# Altium schematic sheet BalEv_STM_v1_0.SchDoc
size A4; CompanyName: HESSO; Address1: Route du Rawyl 47; Address2: 1950 Sion; Address3: Switzerland; DocumentNumber: 3; SheetNumber: 2; SheetTotal: 8; PageSetup: Record=PageOptions|CenterHorizontal=True|CenterVertical=True|PrintScale=1.00|XCorrection=1.00|YCorrection=1.00|PrintKind=1|BorderSize=5000000|LeftOffset=0|BottomOffset=0|Orientation=2|PaperLength=1000|PaperWidth=1000|Scale=100|PaperSource=15|PrintQuality=1200|MediaType=1|DitherType=10|PrintScaleMode=1|PaperKind=A4|PaperIndex=9; ProjectName: Project Name
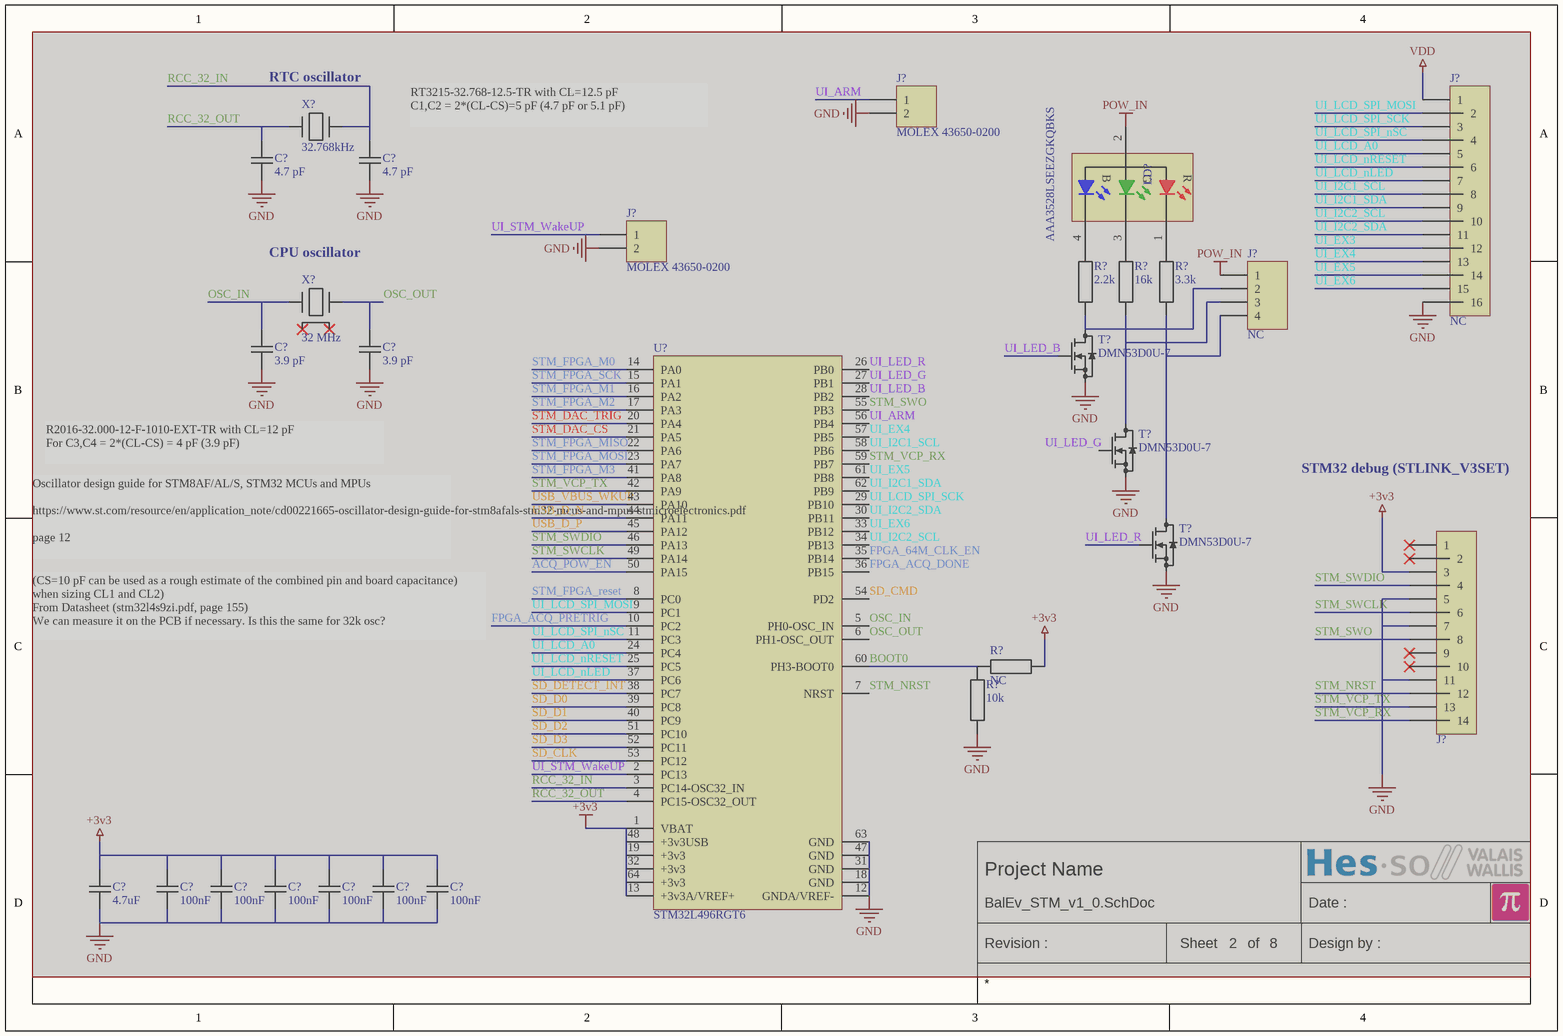
[diagram p0: BalEv_STM_v1_0.SchDoc]

## Parts
(Parts that share a designator on the sheet are numbered #1, #2 ... from top to bottom, then left to right.)
C?#1  4.7 pF  [CAPACITOR 1005 REFLOW]  (masked out: inside a compile mask, not in the netlist)
C?#2  4.7 pF  [CAPACITOR 1005 REFLOW]  (masked out: inside a compile mask, not in the netlist)
C?#3  3.9 pF  [CAPACITOR 1005 REFLOW]  (masked out: inside a compile mask, not in the netlist)
C?#4  3.9 pF  [CAPACITOR 1005 REFLOW]  (masked out: inside a compile mask, not in the netlist)
C?#5  4.7uF  [CAPACITOR 1608 REFLOW]  (masked out: inside a compile mask, not in the netlist)
C?#6  100nF  [CAPACITOR 1005 REFLOW]  (masked out: inside a compile mask, not in the netlist)
C?#7  100nF  [CAPACITOR 1005 REFLOW]  (masked out: inside a compile mask, not in the netlist)
C?#8  100nF  [CAPACITOR 1005 REFLOW]  (masked out: inside a compile mask, not in the netlist)
C?#9  100nF  [CAPACITOR 1005 REFLOW]  (masked out: inside a compile mask, not in the netlist)
C?#10  100nF  [CAPACITOR 1005 REFLOW]  (masked out: inside a compile mask, not in the netlist)
C?#11  100nF  [CAPACITOR 1005 REFLOW]  (masked out: inside a compile mask, not in the netlist)
J?#1  MOLEX 43650-0200  [MOLEX 43650-0200]  (masked out: inside a compile mask, not in the netlist)
J?#2  NC  [FlatCable2x8 2MM Right Angle TH FCI 98614-G61-16ULF]  (masked out: inside a compile mask, not in the netlist)
J?#3  MOLEX 43650-0200  [MOLEX 43650-0200]  (masked out: inside a compile mask, not in the netlist)
J?#4  NC  [MOLEX 43650-0400]  (masked out: inside a compile mask, not in the netlist)
J?#5  *  [PinHeader2x7 P1.27]  (value not drawn)  (masked out: inside a compile mask, not in the netlist)
LD?  AAA3528LSEEZGKQBKS  [LED Kingbright AAA3528LSEEZGKQBKS]  (masked out: inside a compile mask, not in the netlist)
R?#1  2.2k  [RESISTOR 1005 REFLOW]  (masked out: inside a compile mask, not in the netlist)
R?#2  16k  [RESISTOR 1005 REFLOW]  (masked out: inside a compile mask, not in the netlist)
R?#3  3.3k  [RESISTOR 1005 REFLOW]  (masked out: inside a compile mask, not in the netlist)
R?#4  10k  [RESISTOR 1005 REFLOW]  (masked out: inside a compile mask, not in the netlist)
R?#5  NC  [RESISTOR 1005 REFLOW]  (masked out: inside a compile mask, not in the netlist)
T?#1  DMN53D0U-7  [SOT23 P0.95 C1.6x3.0 H1.3]  (masked out: inside a compile mask, not in the netlist)
T?#2  DMN53D0U-7  [SOT23 P0.95 C1.6x3.0 H1.3]  (masked out: inside a compile mask, not in the netlist)
T?#3  DMN53D0U-7  [SOT23 P0.95 C1.6x3.0 H1.3]  (masked out: inside a compile mask, not in the netlist)
U?  STM32L496RGT6  [LQFP64 P0.5 C10.0x10.0 H1.6]  (masked out: inside a compile mask, not in the netlist)
X?#1  32.768kHz  [Crystal C3.2x1.5 Abracon ABS07]  (masked out: inside a compile mask, not in the netlist)
X?#2  32 MHz  [Crystal C2.0x1.6 Abracon ABM11W]  (masked out: inside a compile mask, not in the netlist)

## Notes on the sheet
- (near X?#1) RTC oscillator
- (near C?#2) RT3215-32.768-12.5-TR with CL=12.5 pF
  C1,C2 = 2*(CL-CS)=5 pF (4.7 pF or 5.1 pF)
- (near X?#2) CPU oscillator
- R2016-32.000-12-F-1010-EXT-TR with CL=12 pF
  For C3,C4 = 2*(CL-CS) = 4 pF (3.9 pF)
- STM32 debug (STLINK_V3SET)
- Oscillator design guide for STM8AF/AL/S, STM32 MCUs and MPUs
  https://www.st.com/resource/en/application_note/cd00221665-oscillator-design-guide-for-stm8afals-stm32-mcus-and-mpus-stmicroelectronics.pdf
  page 12
- (CS=10 pF can be used as a rough estimate of the combined pin and board capacitance) when sizing CL1 and CL2)
  From Datasheet (stm32l4s9zi.pdf, page 155)
  We can measure it on the PCB if necessary. Is this the same for 32k osc?
- Date :
- Revision :
- Sheet
- of
- Design by :

## Library data of the parts
C?#1-C?#11 = Capacitor: STOCK: NO
  C?#1 C?#2: Value: 4.7 pF
  C?#3 C?#4: Value: 3.9 pF
  C?#5: Value: 4.7uF
  C?#6-C?#11: Value: 100nF
J?#1 J?#3 = MOLEX 43650-0200: Micro-Fit 3.0 Right-Angle Header, 3.00mm Pitch, Single Row, 2 Circuits MOLEX 43650-0200
J?#2 = FlatCable2x8
J?#4 = MOLEX 43650-0400: Micro-Fit 3.0 Right-Angle Header, 3.00mm Pitch, Single Row, 4 Circuits, MOLEX 43650-0400
J?#5 = PinHeader2x7: Plug connector; Value: *; STOCK: YES
LD? = LED Kingbright AAA3528LSEEZGKQBKS: 3.5x2.8mm SURFACE MOUNT LED LAMP; Value: AAA3528LSEEZGKQBKS
R?#1-R?#5 = Resistor: STOCK: NO
  R?#1: Value: 2.2k
  R?#2: Value: 16k
  R?#3: Value: 3.3k
  R?#4: Value: 10k
  R?#5: Value: NC
T?#1-T?#3 = MOS-N SOT23 G-S-D: Generic MOS-N; Value: DMN53D0U-7
U? = STM32L4X6R_T: Ultra-low-power Arm® Cortex®-M4 32-bit MCU+FPU, 100DMIPS, / up to 1MB Flash, 320KB SRAM, USB OTG FS, audio, ext. SMPS; Value: STM32L496RGT6
X?#1 = Crystal C3.2x1.5 Abracon ABS07: RT3215-32.768-12.5-TR; Value: 32.768kHz; STOCK: YES
X?#2 = Crystal C2.0x1.6 Abracon ABM11W: R2016-32.000-12-F-1010-EXT-TR; Value: 32 MHz; STOCK: YES